# Altium schematic sheet 连接.SchDoc
size A4
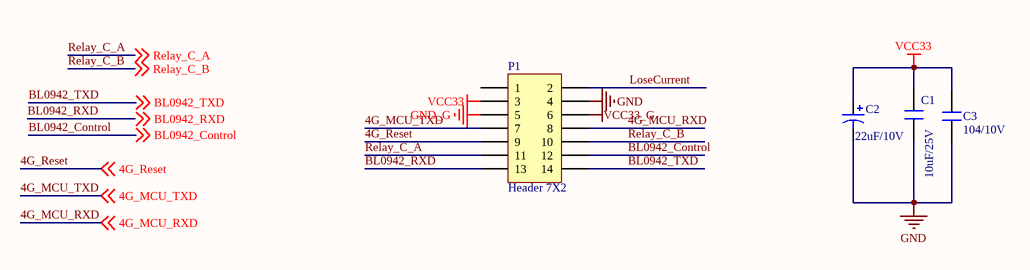
[diagram p0: 连接.SchDoc]

## Parts
C1  10uF/25V  [0603R]
C2  22uF/10V  [0805R]
C3  104/10V  [0603R]
P1  Header 7X2  [HDR2X7]

## Nets
GND: C1.1 C2.2 C3.1 P1.4
GND_G: P1.5
VCC33: C1.2 C2.1 C3.2 P1.3
VCC33_G: P1.6
4G_MCU_RXD: P1.8 ; off-sheet 4G_MCU_RXD
4G_MCU_TXD: P1.7 ; off-sheet 4G_MCU_TXD
4G_Reset: P1.9 ; off-sheet 4G_Reset
BL0942_Control: P1.12 ; off-sheet BL0942_Control
BL0942_RXD: P1.13 ; off-sheet BL0942_RXD
BL0942_TXD: P1.14 ; off-sheet BL0942_TXD
LoseCurrent: P1.2
Relay_C_A: P1.11 ; off-sheet Relay_C_A
Relay_C_B: P1.10 ; off-sheet Relay_C_B

Not connected (* = marked no-connect by the designer): P1 1

## Notes on the sheet
- Labels drawn without touching a wire or pin: BL0942_RXD

## Library data of the parts
C1 = CAP
C2 = Cap Pol1: Polarized Capacitor (Radial); Published: 8-Jun-2000; LatestRevisionDate: 17-Jul-2002; LatestRevisionNote: Re-released for DXP Platform.; PackageReference: RB7.6-15; Publisher: Altium Limited; PackageDescription: Polarized Capacitor (Radial); 2 Leads
C3 = CAP_1
P1 = Header 7X2: Header, 7-Pin, Dual row; LatestRevisionDate: 17-Jul-2002; LatestRevisionNote: Re-released for DXP Platform.; Publisher: Altium Limited